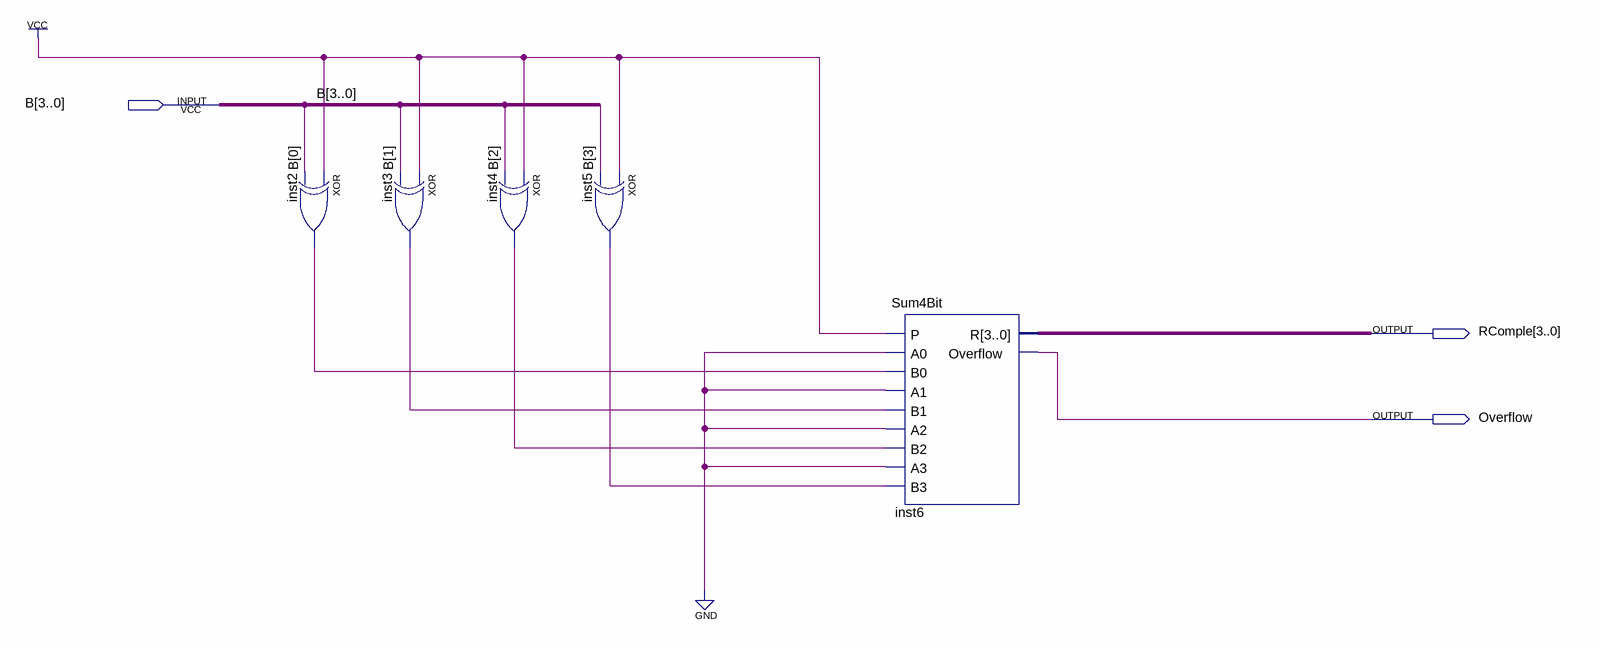
[diagram p0: schematic sheet]
// Quartus schematic Complemento2.bdf as structural Verilog: 5 symbols, 3 pins
module Complemento2 (
  input  [3:0] B,
  output [3:0] RComple,
  output Overflow
);

  wire inst2_out, inst3_out, inst4_out, inst5_out;

  xor inst2 (inst2_out, 1'b1, B[0]);
  xor inst3 (inst3_out, 1'b1, B[1]);
  xor inst4 (inst4_out, 1'b1, B[2]);
  xor inst5 (inst5_out, 1'b1, B[3]);
  Sum4Bit inst6 (
    .P(1'b1), .A0(1'b0), .B0(inst2_out), .A1(1'b0), .B1(inst3_out), .A2(1'b0), .B2(inst4_out), .A3(1'b0),
    .B3(inst5_out), .R(RComple), .Overflow(Overflow));
endmodule
